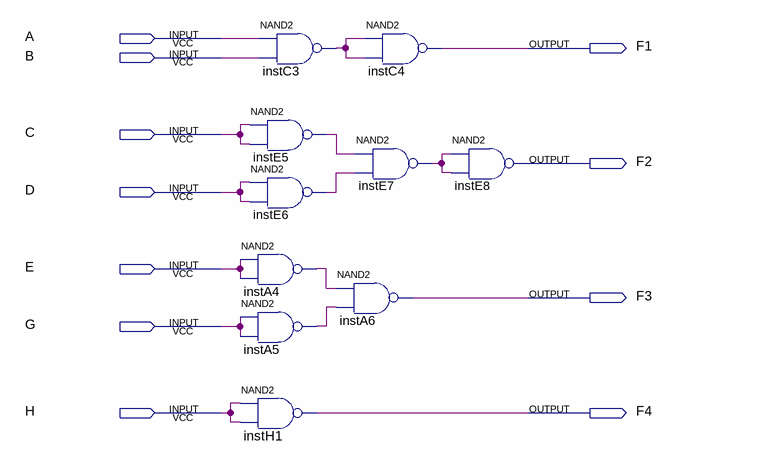
[diagram p0: schematic sheet]
// Quartus schematic P0Gates.bdf as structural Verilog: 10 symbols, 11 pins
module P0Gates (
  input  A,
  input  B,
  input  C,
  input  D,
  input  E,
  input  G,
  input  H,
  output F1,
  output F2,
  output F3,
  output F4
);

  wire instA4_out, instA5_out, instC3_out, instE5_out, instE6_out, instE7_out;

  nand instA4 (instA4_out, E, E);
  nand instA5 (instA5_out, G, G);
  nand instH1 (F4, H, H);
  nand instC3 (instC3_out, A, B);
  nand instE5 (instE5_out, C, C);
  nand instE6 (instE6_out, D, D);
  nand instC4 (F1, instC3_out, instC3_out);
  nand instE7 (instE7_out, instE5_out, instE6_out);
  nand instA6 (F3, instA4_out, instA5_out);
  nand instE8 (F2, instE7_out, instE7_out);
endmodule
